# Altium schematic sheet Programmer_Debugger.SchDoc
size A; SheetNumber: 3; SheetTotal: 5
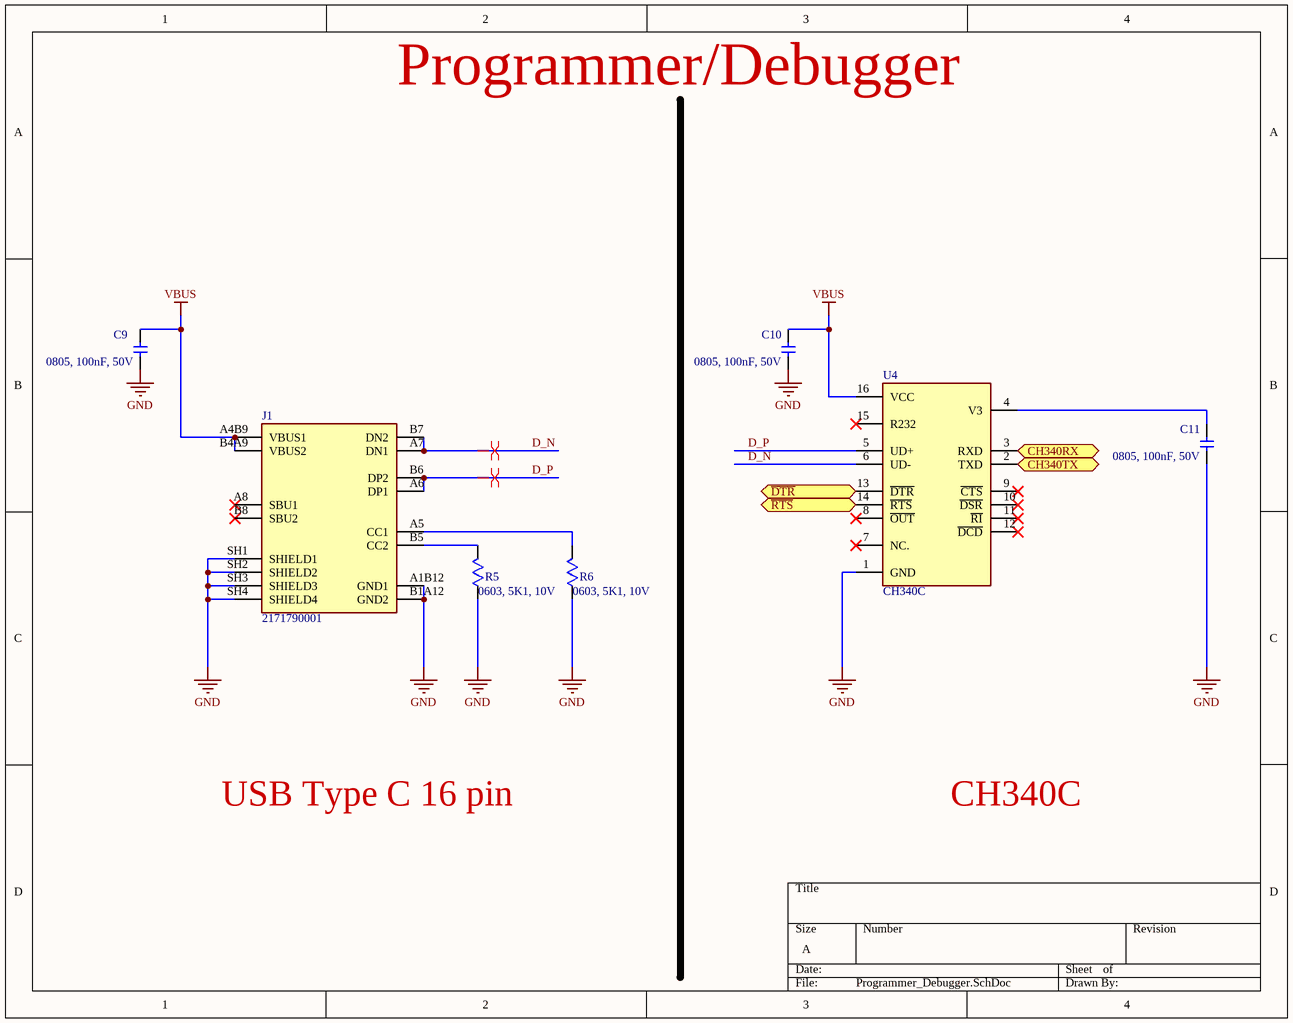
[diagram p0: Programmer_Debugger.SchDoc]

## Parts
C9  0805, 100nF, 50V  [C0805]
C10  0805, 100nF, 50V  [C0805]
C11  0805, 100nF, 50V  [C0805]
J1  2171790001  [MOLEX_2171790001]
R5  0603, 5K1, 10V  [RES0603]
R6  0603, 5K1, 10V  [RES0603]
U4  CH340C  [SOIC127P600X180-16N]

## Ports
CH340RX (bidir), CH340TX (bidir), ~{DTR} (bidir), ~{RTS} (bidir)

## Nets
GND: C9.1 C10.1 C11.1 J1.A1B12(GND1) J1.B1A12(GND2) J1.SH1(SHIELD1) J1.SH2(SHIELD2) J1.SH3(SHIELD3) J1.SH4(SHIELD4) R5.1 R6.1 U4.1(GND)
VBUS: C9.2 C10.2 J1.A4B9(VBUS1) J1.B4A9(VBUS2) U4.16(VCC)
CH340RX: U4.3(RXD) ; port CH340RX
CH340TX: U4.2(TXD) ; port CH340TX
~{DTR}: U4.13(~{DTR}) ; port ~{DTR}
D_N: J1.A7(DN1) J1.B7(DN2) U4.6(UD-)
D_P: J1.A6(DP1) J1.B6(DP2) U4.5(UD+)
~{RTS}: U4.14(~{RTS}) ; port ~{RTS}
NetC11_2: C11.2 U4.4(V3)
NetJ1_A5: J1.A5(CC1) R6.2
NetJ1_B5: J1.B5(CC2) R5.2

Not connected (* = marked no-connect by the designer): J1 A8(SBU1)* B8(SBU2)*; U4 7(NC.)* 8(~{OUT})* 9(~{CTS})* 10(~{DSR})* 11(~{RI})* 12(~{DCD})* 15(R232)*

## Layout directives
differential pair; differential pair class diff90: D_N, D_P

## Notes on the sheet
- Programmer/Debugger
- USB Type C 16 pin
- CH340C

## Library data of the parts
C9-C11 = C0805: Part Number: *; MFR: *
J1 = 2171790001: USB Type C - Connector, Top-mount SMT, 16pos | Molex Incorporated 217179-0001; SnapEDA_Link: https://www.snapeda.com/parts/217179-0001/Molex/view-part/?ref=snap; Package: None; Value: *; MF: Molex; MP: 217179-0001; Check_prices: https://www.snapeda.com/parts/217179-0001/Molex/view-part/?ref=eda
R5 R6 = R0603: Part Number: *; MFR: *
U4 = CH340C: USB to serial chip CH340; MF: WCH; Price: None; Availability: Not in stock; MP: CH340C; Package: None; SnapEDA_Link: https://www.snapeda.com/parts/CH340C/WCH/view-part/?ref=snap; Check_prices: https://www.snapeda.com/parts/CH340C/WCH/view-part/?ref=eda; Value: *